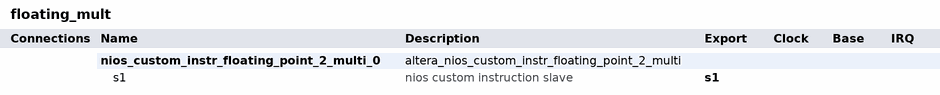
[diagram p0: system contents]
# Platform Designer (Qsys) system floating_mult, Cyclone IV E EP4CE115F29C7
# Parameters at their usual value, and those the tool derives, are not listed.
package require -exact qsys 18.1
create_system floating_mult
set_project_property DEVICE_FAMILY {Cyclone IV E}
set_project_property DEVICE EP4CE115F29C7

add_instance nios_custom_instr_floating_point_2_multi_0 altera_nios_custom_instr_floating_point_2_multi 18.1
set_instance_property nios_custom_instr_floating_point_2_multi_0 AUTO_EXPORT true
set_instance_parameter_value nios_custom_instr_floating_point_2_multi_0 arithmetic_present 1
set_instance_parameter_value nios_custom_instr_floating_point_2_multi_0 conversion_present 1
set_instance_parameter_value nios_custom_instr_floating_point_2_multi_0 root_present 0

# exported interfaces
add_interface s1 nios_custom_instruction end
set_interface_property s1 EXPORT_OF nios_custom_instr_floating_point_2_multi_0.s1

set_interconnect_requirement {$system} qsys_mm.clockCrossingAdapter HANDSHAKE
set_interconnect_requirement {$system} qsys_mm.enableEccProtection FALSE
set_interconnect_requirement {$system} qsys_mm.insertDefaultSlave FALSE
set_interconnect_requirement {$system} qsys_mm.maxAdditionalLatency 1

save_system floating_mult.qsys
